# EAGLE schematic atmega8 (EAGLE 4.15)
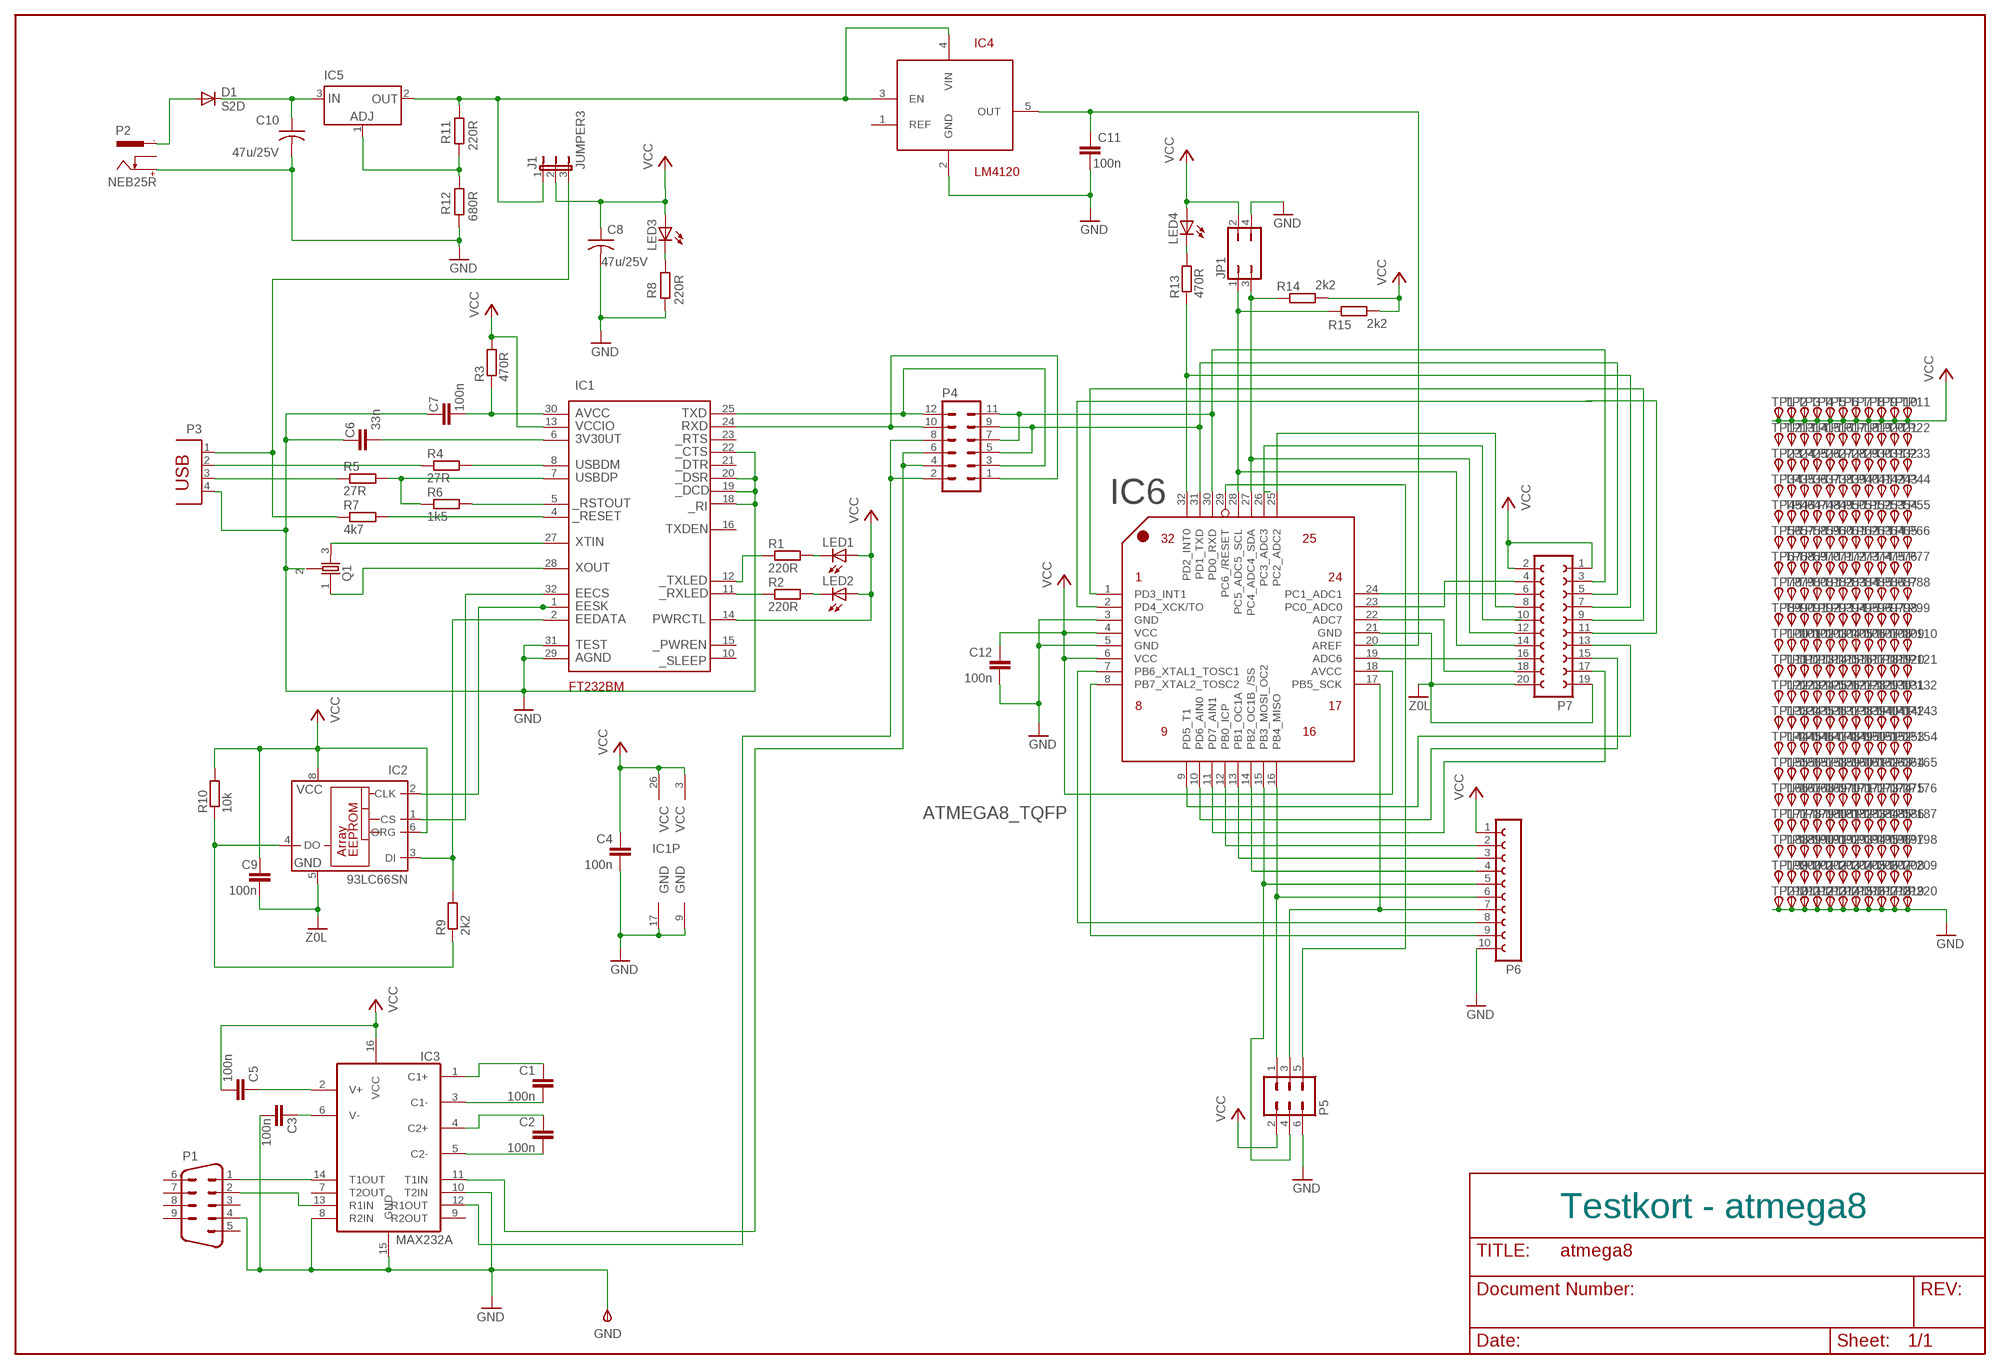
[diagram p0: schematic, sheet 1]

## Parts
C1  100n  C-EUC0805K  [C0805K]
C2  100n  C-EUC0805K  [C0805K]
C3  100n  C-EUC0805K  [C0805K]
C4  100n  C-EUC0805K  [C0805K]
C5  100n  C-EUC0805K  [C0805K]
C6  33n  C-EUC0805K  [C0805K]
C7  100n  C-EUC0805K  [C0805K]
C8  47u/25V  CAP2.5  [CAP2.5]
C9  100n  C-EUC0805K  [C0805K]
C10  47u/25V  CAP2.5  [CAP2.5]
C11  100n  C-EUC0805K  [C0805K]
C12  100n  C-EUC0805K  [C0805K]
D1  S2D  DIODE-SMB  [SMB]
GND  TPSPAD1-17  [P1-17]
IC1  FT232BM  [TQFP32-08]
IC2  93LC66SN  [SO-08]
IC3  MAX232A  [SO16]
IC4  LM4120  [SOT23-5]
IC5  LM317EMP  [SOT223]
IC6  ATMEGA8_TQFP  [TQFP-32]
J1  JUMPER3  [JUMPER3]
JP1  JP2Q  [JP2Q]
LED1  LED3MM  [LED3MM]
LED2  LED3MM  [LED3MM]
LED3  LED3MM  [LED3MM]
LED4  LED3MM  [LED3MM]
P1  M09H  [M09H]
P2  NEB25R  [NEB25R]
P3  PN61729  [PN61729]
P4  MA06-2  [MA06-2]
P5  MA03-2  [MA03-2]
P6  FE10-1  [FE10]
P7  FE10-2  [FE10-2]
Q1  MURATA_RESONATOR  [MURATA_RESONATOR]
R1  220R  R-EU_M0805  [M0805]
R2  220R  R-EU_M0805  [M0805]
R3  470R  R-EU_M0805  [M0805]
R4  27R  R-EU_M0805  [M0805]
R5  27R  R-EU_M0805  [M0805]
R6  1k5  R-EU_M0805  [M0805]
R7  4k7  R-EU_M0805  [M0805]
R8  220R  R-EU_M0805  [M0805]
R9  2k2  R-EU_M0805  [M0805]
R10  10k  R-EU_M0805  [M0805]
R11  220R  R-EU_M0805  [M0805]
R12  680R  R-EU_M0805  [M0805]
R13  470R  R-EU_M0805  [M0805]
R14  2k2  R-EU_M0805  [M0805]
R15  2k2  R-EU_M0805  [M0805]
TP1  TPSPAD1-20  [P1-20]
TP2  TPSPAD1-20  [P1-20]
TP3  TPSPAD1-20  [P1-20]
TP4  TPSPAD1-20  [P1-20]
TP5  TPSPAD1-20  [P1-20]
TP6  TPSPAD1-20  [P1-20]
TP7  TPSPAD1-20  [P1-20]
TP8  TPSPAD1-20  [P1-20]
TP9  TPSPAD1-20  [P1-20]
TP10  TPSPAD1-20  [P1-20]
TP11  TPSPAD1-20  [P1-20]
TP12  TPSPAD1-20  [P1-20]
TP13  TPSPAD1-20  [P1-20]
TP14  TPSPAD1-20  [P1-20]
TP15  TPSPAD1-20  [P1-20]
TP16  TPSPAD1-20  [P1-20]
TP17  TPSPAD1-20  [P1-20]
TP18  TPSPAD1-20  [P1-20]
TP19  TPSPAD1-20  [P1-20]
TP20  TPSPAD1-20  [P1-20]
TP21  TPSPAD1-20  [P1-20]
TP22  TPSPAD1-20  [P1-20]
TP23  TPSPAD1-20  [P1-20]
TP24  TPSPAD1-20  [P1-20]
TP25  TPSPAD1-20  [P1-20]
TP26  TPSPAD1-20  [P1-20]
TP27  TPSPAD1-20  [P1-20]
TP28  TPSPAD1-20  [P1-20]
TP29  TPSPAD1-20  [P1-20]
TP30  TPSPAD1-20  [P1-20]
TP31  TPSPAD1-20  [P1-20]
TP32  TPSPAD1-20  [P1-20]
TP33  TPSPAD1-20  [P1-20]
TP34  TPSPAD1-20  [P1-20]
TP35  TPSPAD1-20  [P1-20]
TP36  TPSPAD1-20  [P1-20]
TP37  TPSPAD1-20  [P1-20]
TP38  TPSPAD1-20  [P1-20]
TP39  TPSPAD1-20  [P1-20]
TP40  TPSPAD1-20  [P1-20]
TP41  TPSPAD1-20  [P1-20]
TP42  TPSPAD1-20  [P1-20]
TP43  TPSPAD1-20  [P1-20]
TP44  TPSPAD1-20  [P1-20]
TP45  TPSPAD1-20  [P1-20]
TP46  TPSPAD1-20  [P1-20]
TP47  TPSPAD1-20  [P1-20]
TP48  TPSPAD1-20  [P1-20]
TP49  TPSPAD1-20  [P1-20]
TP50  TPSPAD1-20  [P1-20]
TP51  TPSPAD1-20  [P1-20]
TP52  TPSPAD1-20  [P1-20]
TP53  TPSPAD1-20  [P1-20]
TP54  TPSPAD1-20  [P1-20]
TP55  TPSPAD1-20  [P1-20]
TP56  TPSPAD1-20  [P1-20]
TP57  TPSPAD1-20  [P1-20]
TP58  TPSPAD1-20  [P1-20]
TP59  TPSPAD1-20  [P1-20]
TP60  TPSPAD1-20  [P1-20]
TP61  TPSPAD1-20  [P1-20]
TP62  TPSPAD1-20  [P1-20]
TP63  TPSPAD1-20  [P1-20]
TP64  TPSPAD1-20  [P1-20]
TP65  TPSPAD1-20  [P1-20]
TP66  TPSPAD1-20  [P1-20]
TP67  TPSPAD1-20  [P1-20]
TP68  TPSPAD1-20  [P1-20]
TP69  TPSPAD1-20  [P1-20]
TP70  TPSPAD1-20  [P1-20]
TP71  TPSPAD1-20  [P1-20]
TP72  TPSPAD1-20  [P1-20]
TP73  TPSPAD1-20  [P1-20]
TP74  TPSPAD1-20  [P1-20]
TP75  TPSPAD1-20  [P1-20]
TP76  TPSPAD1-20  [P1-20]
TP77  TPSPAD1-20  [P1-20]
TP78  TPSPAD1-20  [P1-20]
TP79  TPSPAD1-20  [P1-20]
TP80  TPSPAD1-20  [P1-20]
TP81  TPSPAD1-20  [P1-20]
TP82  TPSPAD1-20  [P1-20]
TP83  TPSPAD1-20  [P1-20]
TP84  TPSPAD1-20  [P1-20]
TP85  TPSPAD1-20  [P1-20]
TP86  TPSPAD1-20  [P1-20]
TP87  TPSPAD1-20  [P1-20]
TP88  TPSPAD1-20  [P1-20]
TP89  TPSPAD1-20  [P1-20]
TP90  TPSPAD1-20  [P1-20]
TP91  TPSPAD1-20  [P1-20]
TP92  TPSPAD1-20  [P1-20]
TP93  TPSPAD1-20  [P1-20]
TP94  TPSPAD1-20  [P1-20]
TP95  TPSPAD1-20  [P1-20]
TP96  TPSPAD1-20  [P1-20]
TP97  TPSPAD1-20  [P1-20]
TP98  TPSPAD1-20  [P1-20]
TP99  TPSPAD1-20  [P1-20]
TP100  TPSPAD1-20  [P1-20]
TP101  TPSPAD1-20  [P1-20]
TP102  TPSPAD1-20  [P1-20]
TP103  TPSPAD1-20  [P1-20]
TP104  TPSPAD1-20  [P1-20]
TP105  TPSPAD1-20  [P1-20]
TP106  TPSPAD1-20  [P1-20]
TP107  TPSPAD1-20  [P1-20]
TP108  TPSPAD1-20  [P1-20]
TP109  TPSPAD1-20  [P1-20]
TP110  TPSPAD1-20  [P1-20]
TP111  TPSPAD1-20  [P1-20]
TP112  TPSPAD1-20  [P1-20]
TP113  TPSPAD1-20  [P1-20]
TP114  TPSPAD1-20  [P1-20]
TP115  TPSPAD1-20  [P1-20]
TP116  TPSPAD1-20  [P1-20]
TP117  TPSPAD1-20  [P1-20]
TP118  TPSPAD1-20  [P1-20]
TP119  TPSPAD1-20  [P1-20]
TP120  TPSPAD1-20  [P1-20]
TP121  TPSPAD1-20  [P1-20]
TP122  TPSPAD1-20  [P1-20]
TP123  TPSPAD1-20  [P1-20]
TP124  TPSPAD1-20  [P1-20]
TP125  TPSPAD1-20  [P1-20]
TP126  TPSPAD1-20  [P1-20]
TP127  TPSPAD1-20  [P1-20]
TP128  TPSPAD1-20  [P1-20]
TP129  TPSPAD1-20  [P1-20]
TP130  TPSPAD1-20  [P1-20]
TP131  TPSPAD1-20  [P1-20]
TP132  TPSPAD1-20  [P1-20]
TP133  TPSPAD1-20  [P1-20]
TP134  TPSPAD1-20  [P1-20]
TP135  TPSPAD1-20  [P1-20]
TP136  TPSPAD1-20  [P1-20]
TP137  TPSPAD1-20  [P1-20]
TP138  TPSPAD1-20  [P1-20]
TP139  TPSPAD1-20  [P1-20]
TP140  TPSPAD1-20  [P1-20]
TP141  TPSPAD1-20  [P1-20]
TP142  TPSPAD1-20  [P1-20]
TP143  TPSPAD1-20  [P1-20]
TP144  TPSPAD1-20  [P1-20]
TP145  TPSPAD1-20  [P1-20]
TP146  TPSPAD1-20  [P1-20]
TP147  TPSPAD1-20  [P1-20]
TP148  TPSPAD1-20  [P1-20]
TP149  TPSPAD1-20  [P1-20]
TP150  TPSPAD1-20  [P1-20]
TP151  TPSPAD1-20  [P1-20]
TP152  TPSPAD1-20  [P1-20]
TP153  TPSPAD1-20  [P1-20]
TP154  TPSPAD1-20  [P1-20]
TP155  TPSPAD1-20  [P1-20]
TP156  TPSPAD1-20  [P1-20]
TP157  TPSPAD1-20  [P1-20]
TP158  TPSPAD1-20  [P1-20]
TP159  TPSPAD1-20  [P1-20]
TP160  TPSPAD1-20  [P1-20]
TP161  TPSPAD1-20  [P1-20]
TP162  TPSPAD1-20  [P1-20]
TP163  TPSPAD1-20  [P1-20]
TP164  TPSPAD1-20  [P1-20]
TP165  TPSPAD1-20  [P1-20]
TP166  TPSPAD1-20  [P1-20]
TP167  TPSPAD1-20  [P1-20]
TP168  TPSPAD1-20  [P1-20]
TP169  TPSPAD1-20  [P1-20]
TP170  TPSPAD1-20  [P1-20]
TP171  TPSPAD1-20  [P1-20]
TP172  TPSPAD1-20  [P1-20]
TP173  TPSPAD1-20  [P1-20]
TP174  TPSPAD1-20  [P1-20]
TP175  TPSPAD1-20  [P1-20]
TP176  TPSPAD1-20  [P1-20]
TP177  TPSPAD1-20  [P1-20]
TP178  TPSPAD1-20  [P1-20]
TP179  TPSPAD1-20  [P1-20]
TP180  TPSPAD1-20  [P1-20]
TP181  TPSPAD1-20  [P1-20]
TP182  TPSPAD1-20  [P1-20]
TP183  TPSPAD1-20  [P1-20]
TP184  TPSPAD1-20  [P1-20]
TP185  TPSPAD1-20  [P1-20]
TP186  TPSPAD1-20  [P1-20]
TP187  TPSPAD1-20  [P1-20]
TP188  TPSPAD1-20  [P1-20]
TP189  TPSPAD1-20  [P1-20]
TP190  TPSPAD1-20  [P1-20]
TP191  TPSPAD1-20  [P1-20]
TP192  TPSPAD1-20  [P1-20]
TP193  TPSPAD1-20  [P1-20]
TP194  TPSPAD1-20  [P1-20]
TP195  TPSPAD1-20  [P1-20]
TP196  TPSPAD1-20  [P1-20]
TP197  TPSPAD1-20  [P1-20]
TP198  TPSPAD1-20  [P1-20]
TP199  TPSPAD1-20  [P1-20]
TP200  TPSPAD1-20  [P1-20]
TP201  TPSPAD1-20  [P1-20]
TP202  TPSPAD1-20  [P1-20]
TP203  TPSPAD1-20  [P1-20]
TP204  TPSPAD1-20  [P1-20]
TP205  TPSPAD1-20  [P1-20]
TP206  TPSPAD1-20  [P1-20]
TP207  TPSPAD1-20  [P1-20]
TP208  TPSPAD1-20  [P1-20]
TP209  TPSPAD1-20  [P1-20]
TP210  TPSPAD1-20  [P1-20]
TP211  TPSPAD1-20  [P1-20]
TP212  TPSPAD1-20  [P1-20]
TP213  TPSPAD1-20  [P1-20]
TP214  TPSPAD1-20  [P1-20]
TP215  TPSPAD1-20  [P1-20]
TP216  TPSPAD1-20  [P1-20]
TP217  TPSPAD1-20  [P1-20]
TP218  TPSPAD1-20  [P1-20]
TP219  TPSPAD1-20  [P1-20]
TP220  TPSPAD1-20  [P1-20]

## Nets
0V: C4.2 C6.1 C7.1 C8.2 C9.2 C10.2 C11.2 IC1.9 IC1.17 IC1.18 IC1.19 IC1.20 IC1.22 IC1.29 IC1.31 IC2.5(GND) IC4.2(GND) IC6.21(GND) JP1.4 P2.+ P3.4 P5.6 P6.10 P7.19 P7.20 Q1.2 R8.1 R12.1 ; supply symbol labelled GND, Z0L
GND: C3.2 GND.1(PP) IC3.8(R2IN) IC3.10(T2IN) IC3.15(GND) P1.4
N$1: IC1.12 R1.1
N$2: IC3.13(R1IN) P1.2
N$3: IC1.11 R2.1
N$4: IC1.1 IC2.2(CLK)
N$5: LED1.K(C) R1.2
N$6: LED2.K(C) R2.2
N$7: C6.2 IC1.6
N$8: C7.2 IC1.30 R3.1
N$9: IC1.8 R4.2
N$10: P3.2 R4.1
N$11: IC1.7 R5.2 R6.1
N$12: P3.3 R5.1
N$13: IC1.5 R6.2
N$14: IC1.4 R7.2
N$15: LED3.K(C) R8.2
N$16: IC1.32 IC2.1(CS)
N$17: C8.1 J1.2 LED3.A
N$18: IC1.27 Q1.3
N$19: IC1.28 Q1.1
N$21: IC1.2 IC2.3(DI) R9.2
N$22: IC1.24 P4.1 P4.10
N$23: IC3.11(T1IN) P4.4 P4.6
N$24: IC3.14(T1OUT) P1.1
N$25: IC3.12(R1OUT) P4.2 P4.8
N$26: IC1.25 P4.3 P4.12
N$27: IC6.31(PD1_TXD) P4.5 P4.9 P7.5
N$28: IC6.30(PD0_RXD) P4.7 P4.11 P7.3
N$29: D1.A P2.-
N$30: C10.1 D1.C IC5.3
N$31: J1.3 P3.1 R7.1
N$32: IC6.32(PD2_INT0) P7.7
N$33: C11.1 IC4.5(OUT)
N$34: IC5.1 R11.1 R12.2
N$35: IC4.3(EN) IC4.4(VIN) IC5.2 J1.1 R11.2
N$36: C2.2 IC3.5(C2-)
N$37: C2.1 IC3.4(C2+)
N$38: C1.2 IC3.3(C1-)
N$39: C1.1 IC3.1(C1+)
N$40: C5.1 IC3.2(V+)
N$41: C3.1 IC3.6(V-)
N$42: IC6.11(PD7_AIN1) P7.17
N$43: IC6.10(PD6_AIN0) P7.15
N$44: R13.1
N$45: LED4.K(C) R13.2
N$46: IC2.4(DO) R9.1 R10.1
N$48: IC6.1(PD3_INT1) P7.9
N$49: IC6.2(PD4_XCK/TO) P7.11
N$50: IC6.9(PD5_T1) P7.13
N$51: IC6.16(PB4_MISO) P5.1 P6.6
N$52: C12.2 IC6.3(GND) IC6.5(GND)
N$53: IC6.17(PB5_SCK) P5.3 P6.7
N$54: IC6.7(PB6_XTAL1_TOSC1) P6.8
N$55: IC6.8(PB7_XTAL2_TOSC2) P6.9
N$56: IC6.12(PB0_ICP) P6.2
N$57: IC6.13(PB1_OC1A) P6.3
N$58: IC6.14(PB2_OC1B_/SS) P6.4
N$59: IC6.15(PB3_MOSI_OC2) P5.4 P6.5
N$60: IC6.29(PC6_/RESET) P5.5
N$61: IC6.22(ADC7) P7.18
N$62: IC6.19(ADC6) P7.16
N$63: IC6.28(PC5_ADC5_SCL) JP1.1 P7.14 R15.1
N$64: IC6.27(PC4_ADC4_SDA) JP1.3 P7.12 R14.1
N$66: IC6.25(PC2_ADC2) P7.8
N$67: IC6.24(PC1_ADC1) P7.6
N$68: IC6.23(PC0_ADC0) P7.4
VCC: C4.1 C5.2 C9.1 C12.1 IC1.3 IC1.13 IC1.14 IC1.26 IC2.6(ORG) IC2.8(VCC) IC3.16(VCC) IC6.4(VCC) IC6.6(VCC) IC6.18(AVCC) JP1.2 LED1.A LED2.A LED4.A P5.2 P6.1 P7.1 P7.2 R3.2 R10.2 R14.2 R15.2 TP1.1(PP) TP2.1(PP) TP3.1(PP) TP4.1(PP) TP5.1(PP) TP6.1(PP) TP7.1(PP) TP8.1(PP) TP9.1(PP) TP10.1(PP) TP11.1(PP)
ZE0V: TP210.1(PP) TP211.1(PP) TP212.1(PP) TP213.1(PP) TP214.1(PP) TP215.1(PP) TP216.1(PP) TP217.1(PP) TP218.1(PP) TP219.1(PP) TP220.1(PP) ; supply symbol labelled GND
Unconnected: IC1.10 IC1.15 IC1.16 IC1.21 IC1.23 IC2.7(NU) IC3.7(T2OUT) IC3.9(R2OUT) IC4.1(REF) IC6.26(PC3_ADC3) P1.3 P1.5 P1.6 P1.7 P1.8 P1.9 P2.C P7.10 TP12.1(PP) TP13.1(PP) TP14.1(PP) TP15.1(PP) TP16.1(PP) TP17.1(PP) TP18.1(PP) TP19.1(PP) TP20.1(PP) TP21.1(PP) TP22.1(PP) TP23.1(PP) TP24.1(PP) TP25.1(PP) TP26.1(PP) TP27.1(PP) TP28.1(PP) TP29.1(PP) TP30.1(PP) TP31.1(PP) TP32.1(PP) TP33.1(PP) TP34.1(PP) TP35.1(PP) TP36.1(PP) TP37.1(PP) TP38.1(PP) TP39.1(PP) TP40.1(PP) TP41.1(PP) TP42.1(PP) TP43.1(PP) TP44.1(PP) TP45.1(PP) TP46.1(PP) TP47.1(PP) TP48.1(PP) TP49.1(PP) TP50.1(PP) TP51.1(PP) TP52.1(PP) TP53.1(PP) TP54.1(PP) TP55.1(PP) TP56.1(PP) TP57.1(PP) TP58.1(PP) TP59.1(PP) TP60.1(PP) TP61.1(PP) TP62.1(PP) TP63.1(PP) TP64.1(PP) TP65.1(PP) TP66.1(PP) TP67.1(PP) TP68.1(PP) TP69.1(PP) TP70.1(PP) TP71.1(PP) TP72.1(PP) TP73.1(PP) TP74.1(PP) TP75.1(PP) TP76.1(PP) TP77.1(PP) TP78.1(PP) TP79.1(PP) TP80.1(PP) TP81.1(PP) TP82.1(PP) TP83.1(PP) TP84.1(PP) TP85.1(PP) TP86.1(PP) TP87.1(PP) TP88.1(PP) TP89.1(PP) TP90.1(PP) TP91.1(PP) TP92.1(PP) TP93.1(PP) TP94.1(PP) TP95.1(PP) TP96.1(PP) TP97.1(PP) TP98.1(PP) TP99.1(PP) TP100.1(PP) TP101.1(PP) TP102.1(PP) TP103.1(PP) TP104.1(PP) TP105.1(PP) TP106.1(PP) TP107.1(PP) TP108.1(PP) TP109.1(PP) TP110.1(PP) TP111.1(PP) TP112.1(PP) TP113.1(PP) TP114.1(PP) TP115.1(PP) TP116.1(PP) TP117.1(PP) TP118.1(PP) TP119.1(PP) TP120.1(PP) TP121.1(PP) TP122.1(PP) TP123.1(PP) TP124.1(PP) TP125.1(PP) TP126.1(PP) TP127.1(PP) TP128.1(PP) TP129.1(PP) TP130.1(PP) TP131.1(PP) TP132.1(PP) TP133.1(PP) TP134.1(PP) TP135.1(PP) TP136.1(PP) TP137.1(PP) TP138.1(PP) TP139.1(PP) TP140.1(PP) TP141.1(PP) TP142.1(PP) TP143.1(PP) TP144.1(PP) TP145.1(PP) TP146.1(PP) TP147.1(PP) TP148.1(PP) TP149.1(PP) TP150.1(PP) TP151.1(PP) TP152.1(PP) TP153.1(PP) TP154.1(PP) TP155.1(PP) TP156.1(PP) TP157.1(PP) TP158.1(PP) TP159.1(PP) TP160.1(PP) TP161.1(PP) TP162.1(PP) TP163.1(PP) TP164.1(PP) TP165.1(PP) TP166.1(PP) TP167.1(PP) TP168.1(PP) TP169.1(PP) TP170.1(PP) TP171.1(PP) TP172.1(PP) TP173.1(PP) TP174.1(PP) TP175.1(PP) TP176.1(PP) TP177.1(PP) TP178.1(PP) TP179.1(PP) TP180.1(PP) TP181.1(PP) TP182.1(PP) TP183.1(PP) TP184.1(PP) TP185.1(PP) TP186.1(PP) TP187.1(PP) TP188.1(PP) TP189.1(PP) TP190.1(PP) TP191.1(PP) TP192.1(PP) TP193.1(PP) TP194.1(PP) TP195.1(PP) TP196.1(PP) TP197.1(PP) TP198.1(PP) TP199.1(PP) TP200.1(PP) TP201.1(PP) TP202.1(PP) TP203.1(PP) TP204.1(PP) TP205.1(PP) TP206.1(PP) TP207.1(PP) TP208.1(PP) TP209.1(PP)

## Notes on the sheet
- Testkort - atmega8

## Power pins joined to a net without a drawn wire
AREF: IC6.20(AREF)

## Library data of the parts
C1-C7 C9 C11 C12 = rcl:C-EU: CAPACITOR, European symbol
C8 C10 = lbm:CAP2.5
D1 = diode:DIODE-: DIODE
GND TP1-TP220 = testpad:TPS: TEST PIN
IC1 = lbm:FT232BM: MICROCONTROLLER 2 Kbytes FLASH 128 bytes SRAM 128 bytes EEPROM UART 6-channel 10-bit ADC
IC2 = microchip:93*: Serial EPROM 1 K/2 K/4 K, low voltage, Microwire
IC3 = lbm:MAX232A
IC4 = lbm:LM4120
IC5 = lbm:LM317EMP: VOLTAGE REGULATOR with shutdown
IC6 = atmel_prototype_header:ATMEGA8: IC AVR MCU 8K LV 8MHZ IND 32TQFP , Atmel Part number ATMEGA8L-8AI
J1 = lbm:JUMPER3
JP1 = jumper:JP2Q: JUMPER
LED1-LED4 = led:LED: LED OSRAM: - CHIPLED LG R971, LG N971, LY N971, LG Q971, LY Q971, LO R971, LY R971 LH N974, LH R974 LS Q976, LO Q976, LY Q976 LO Q996 - Hyper CHIPLED LW Q18S LB Q993, LB Q99A, LB R99A - SideLED LS A670, LO A670, LY A670, LG A670, LP A670 LB A673, LV A673, LT A673, LW A673 LH A674 LY A675 LS A676, LA A676, LO A676, LY A676, LW A676 LS A679, LY A679, LG A679 - Hyper Micro SIDELED® LS Y876, LA Y876, LO Y876, LY Y876 LT Y87S - SmartLED LW L88C, LW L88S LB L89C, LB L89S, LG L890 LS L89K, LO L89K, LY L89K LS L896, LA L896, LO L896, LY L896 - TOPLED LS T670, LO T670, LY T670, LG T670, LP T670 LSG T670, LSP T670, LSY T670, LOP T670, LYG T670 LG T671, LOG T671, LSG T671 LB T673, LV T673, LT T673, LW T673 LH T674 LS T676, LA T676, LO T676, LY T676, LB T676, LH T676, LSB T676, LW T676 LB T67C, LV T67C, LT T67C, LS T67K, LO T67K, LY T67K, LW E67C LS E67B, LA E67B, LO E67B, LY E67B, LB E67C, LV E67C, LT E67C LW T67C LS T679, LY T679, LG T679 LS T770, LO T770, LY T770, LG T770, LP T770 LB T773, LV T773, LT T773, LW T773 LH T774 LS E675, LA E675, LY E675, LS T675 LS T776, LA T776, LO T776, LY T776, LB T776 LHGB T686 LT T68C, LB T68C - Hyper Mini TOPLED® LB M676 - Mini TOPLED Santana® LG M470 LS M47K, LO M47K, LY M47K Source: http://www.osram.convergy.de/
P1 = con-subd:M09: SUB-D
P2 = con-lumberg:NEB25R: Klinkeneinbaukupplung
P3 = con-berg:PN61729: BERG USB connector
P4 = con-lstb:MA06-2: PIN HEADER
P5 = con-lstb:MA03-2: PIN HEADER
P6 = con-lsta:FE10-1: FEMALE HEADER
P7 = con-lsta:FE10-2: FEMALE HEADER
Q1 = lbm:MURATA_RESONATOR
R1-R15 = rcl:R-EU_: RESISTOR, European symbol